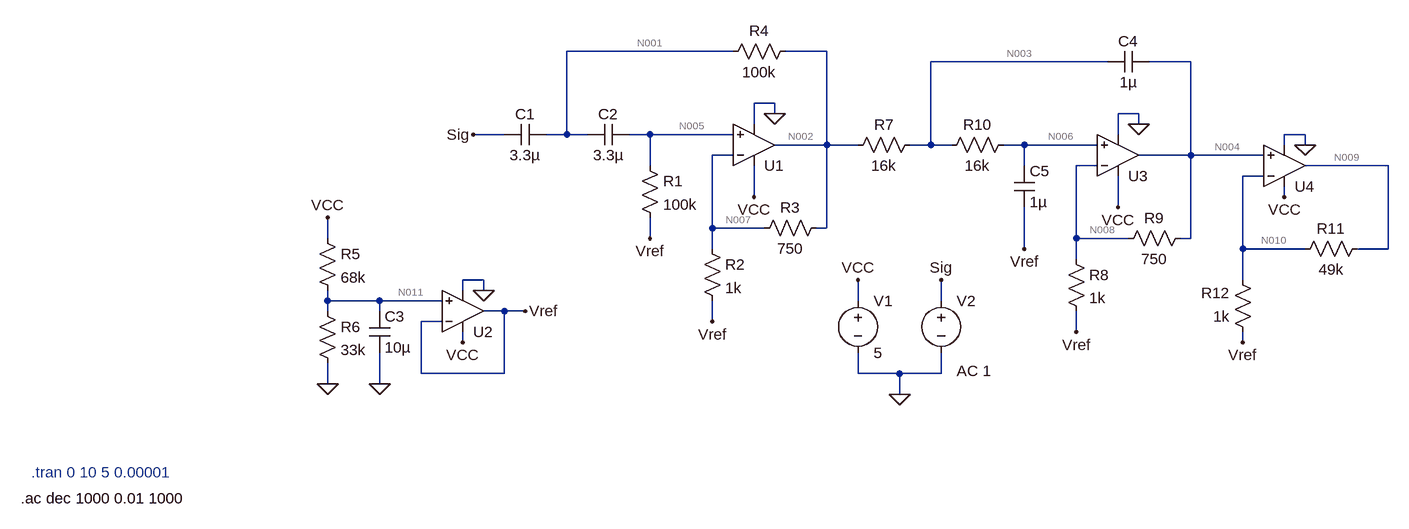
[diagram p0: schematic Draft3.asc]
Draft3.asc, the LTspice schematic file:
Version 4.1
SHEET 1 2260 680
WIRE 1120 -416 864 -416
WIRE 1264 -416 1200 -416
WIRE 1696 -400 1424 -400
WIRE 1824 -400 1760 -400
WIRE 1184 -336 1152 -336
WIRE 1184 -320 1184 -336
WIRE 1744 -320 1712 -320
WIRE 1152 -304 1152 -336
WIRE 1744 -304 1744 -320
WIRE 768 -288 720 -288
WIRE 864 -288 864 -416
WIRE 864 -288 832 -288
WIRE 896 -288 864 -288
WIRE 992 -288 960 -288
WIRE 1120 -288 992 -288
WIRE 1712 -288 1712 -320
WIRE 2000 -288 1968 -288
WIRE 1264 -272 1264 -416
WIRE 1264 -272 1184 -272
WIRE 1312 -272 1264 -272
WIRE 1424 -272 1424 -400
WIRE 1424 -272 1392 -272
WIRE 1456 -272 1424 -272
WIRE 1568 -272 1536 -272
WIRE 1680 -272 1568 -272
WIRE 1968 -272 1968 -288
WIRE 2000 -272 2000 -288
WIRE 1120 -256 1088 -256
WIRE 1824 -256 1824 -400
WIRE 1824 -256 1744 -256
WIRE 1936 -256 1824 -256
WIRE 992 -240 992 -288
WIRE 1568 -240 1568 -272
WIRE 1680 -240 1648 -240
WIRE 2128 -240 2000 -240
WIRE 1936 -224 1904 -224
WIRE 1152 -192 1152 -240
WIRE 1968 -192 1968 -208
WIRE 1712 -176 1712 -224
WIRE 1088 -144 1088 -256
WIRE 1168 -144 1088 -144
WIRE 1264 -144 1264 -272
WIRE 1264 -144 1248 -144
WIRE 496 -128 496 -160
WIRE 992 -128 992 -160
WIRE 1648 -128 1648 -240
WIRE 1728 -128 1648 -128
WIRE 1824 -128 1824 -256
WIRE 1824 -128 1808 -128
WIRE 1088 -112 1088 -144
WIRE 1568 -112 1568 -176
WIRE 1904 -112 1904 -224
WIRE 2000 -112 1904 -112
WIRE 2128 -112 2128 -240
WIRE 2128 -112 2080 -112
WIRE 1648 -96 1648 -128
WIRE 736 -64 704 -64
WIRE 1904 -64 1904 -112
WIRE 704 -48 704 -64
WIRE 736 -48 736 -64
WIRE 496 -32 496 -48
WIRE 576 -32 496 -32
WIRE 672 -32 576 -32
WIRE 1312 -32 1312 -64
WIRE 1440 -32 1440 -64
WIRE 496 -16 496 -32
WIRE 576 -16 576 -32
WIRE 768 -16 736 -16
WIRE 800 -16 768 -16
WIRE 672 0 640 0
WIRE 1088 0 1088 -32
WIRE 1648 16 1648 -16
WIRE 704 32 704 16
WIRE 1904 32 1904 16
WIRE 640 80 640 0
WIRE 768 80 768 -16
WIRE 768 80 640 80
WIRE 1312 80 1312 48
WIRE 1376 80 1312 80
WIRE 1440 80 1440 48
WIRE 1440 80 1376 80
WIRE 496 96 496 64
WIRE 576 96 576 48
WIRE 1376 112 1376 80
FLAG 1376 112 0
FLAG 1312 -64 VCC
FLAG 1440 -64 Sig
FLAG 720 -288 Sig
FLAG 1184 -320 0
FLAG 1152 -192 VCC
FLAG 736 -48 0
FLAG 704 32 VCC
FLAG 576 96 0
FLAG 496 96 0
FLAG 496 -160 VCC
FLAG 800 -16 Vref
FLAG 992 -128 Vref
FLAG 1088 0 Vref
FLAG 1744 -304 0
FLAG 1712 -176 VCC
FLAG 1568 -112 Vref
FLAG 1648 16 Vref
FLAG 2000 -272 0
FLAG 1968 -192 VCC
FLAG 1904 32 Vref
SYMBOL voltage 1312 -48 R0
WINDOW 123 0 0 Left 0
WINDOW 39 0 0 Left 0
SYMATTR InstName V1
SYMATTR Value 5
SYMBOL voltage 1440 -48 R0
WINDOW 123 24 124 Left 2
WINDOW 39 0 0 Left 0
SYMATTR InstName V2
SYMATTR Value ""
SYMATTR Value2 AC 1
SYMBOL cap 832 -304 R90
WINDOW 0 0 32 VBottom 2
WINDOW 3 32 32 VTop 2
SYMATTR InstName C1
SYMATTR Value 3.3µ
SYMBOL cap 960 -304 R90
WINDOW 0 0 32 VBottom 2
WINDOW 3 32 32 VTop 2
SYMATTR InstName C2
SYMATTR Value 3.3µ
SYMBOL res 976 -256 R0
SYMATTR InstName R1
SYMATTR Value 100k
SYMBOL OpAmps\\UniversalOpAmp2 1152 -272 M180
SYMATTR InstName U1
SYMBOL res 1072 -128 R0
SYMATTR InstName R2
SYMATTR Value 1k
SYMBOL res 1264 -160 R90
WINDOW 0 0 56 VBottom 2
WINDOW 3 32 56 VTop 2
SYMATTR InstName R3
SYMATTR Value 750
SYMBOL res 1216 -432 R90
WINDOW 0 0 56 VBottom 2
WINDOW 3 32 56 VTop 2
SYMATTR InstName R4
SYMATTR Value 100k
SYMBOL res 480 -144 R0
SYMATTR InstName R5
SYMATTR Value 68k
SYMBOL res 480 -32 R0
SYMATTR InstName R6
SYMATTR Value 33k
SYMBOL cap 560 -16 R0
SYMATTR InstName C3
SYMATTR Value 10µ
SYMBOL OpAmps\\UniversalOpAmp2 704 -16 M180
SYMATTR InstName U2
SYMBOL OpAmps\\UniversalOpAmp2 1712 -256 M180
SYMATTR InstName U3
SYMBOL res 1632 -112 R0
SYMATTR InstName R8
SYMATTR Value 1k
SYMBOL res 1824 -144 R90
WINDOW 0 0 56 VBottom 2
WINDOW 3 32 56 VTop 2
SYMATTR InstName R9
SYMATTR Value 750
SYMBOL res 1408 -288 R90
WINDOW 0 0 56 VBottom 2
WINDOW 3 32 56 VTop 2
SYMATTR InstName R7
SYMATTR Value 16k
SYMBOL res 1552 -288 R90
WINDOW 0 0 56 VBottom 2
WINDOW 3 32 56 VTop 2
SYMATTR InstName R10
SYMATTR Value 16k
SYMBOL cap 1760 -416 R90
WINDOW 0 0 32 VBottom 2
WINDOW 3 32 32 VTop 2
SYMATTR InstName C4
SYMATTR Value 1µ
SYMBOL cap 1552 -240 R0
SYMATTR InstName C5
SYMATTR Value 1µ
SYMBOL OpAmps\\UniversalOpAmp2 1968 -240 M180
SYMATTR InstName U4
SYMBOL res 2096 -128 R90
WINDOW 0 0 56 VBottom 2
WINDOW 3 32 56 VTop 2
SYMATTR InstName R11
SYMATTR Value 49k
SYMBOL res 1920 32 R180
WINDOW 0 36 76 Left 2
WINDOW 3 36 40 Left 2
SYMATTR InstName R12
SYMATTR Value 1k
TEXT 40 232 Left 2 ;.tran 0 10 5 0.00001
TEXT 24 272 Left 2 !.ac dec 1000 0.01 1000

The netlist it stands for:
* Draft3.asc
V1 VCC 0 5
V2 Sig 0 AC 1
C1 N001 Sig 3.3µ
C2 N005 N001 3.3µ
R1 N005 Vref 100k
X§U1 N005 N007 VCC 0 N002 level2 Avol=1Meg GBW=10Meg Slew=10Meg Ilimit=25m Rail=0 Vos=0 En=0 Enk=0 In=0 Ink=0 Rin=500Meg  ; pins In+ In- V+ V- OUT
R2 N007 Vref 1k
R3 N002 N007 750
R4 N002 N001 100k
R5 VCC N011 68k
R6 N011 0 33k
C3 N011 0 10µ
X§U2 N011 Vref VCC 0 Vref level2 Avol=1Meg GBW=10Meg Slew=10Meg Ilimit=25m Rail=0 Vos=0 En=0 Enk=0 In=0 Ink=0 Rin=500Meg  ; pins In+ In- V+ V- OUT
X§U3 N006 N008 VCC 0 N004 level2 Avol=1Meg GBW=10Meg Slew=10Meg Ilimit=25m Rail=0 Vos=0 En=0 Enk=0 In=0 Ink=0 Rin=500Meg  ; pins In+ In- V+ V- OUT
R8 N008 Vref 1k
R9 N004 N008 750
R7 N003 N002 16k
R10 N006 N003 16k
C4 N004 N003 1µ
C5 N006 Vref 1µ
X§U4 N004 N010 VCC 0 N009 level2 Avol=1Meg GBW=10Meg Slew=10Meg Ilimit=25m Rail=0 Vos=0 En=0 Enk=0 In=0 Ink=0 Rin=500Meg  ; pins In+ In- V+ V- OUT
R11 N009 N010 49k
R12 Vref N010 1k
* .tran 0 10 5 0.00001
.ac dec 1000 0.01 1000
.lib UniversalOpAmp2.lib
.backanno
.end

* Results of the author's LTspice run, read from the files saved beside the schematic
* Operating Point, zero values left out:
*   V(n001) = 1.634 V
*   V(n002) = 1.634 V
*   V(n003) = 1.634 V
*   V(n004) = 1.634 V
*   V(n005) = 1.634 V
*   V(n006) = 1.634 V
*   V(n007) = 1.634 V
*   V(n008) = 1.634 V
*   V(n009) = 1.665 V
*   V(n010) = 1.634 V
*   V(n011) = 1.634 V
*   V(vcc) = 5 V
*   V(vref) = 1.634 V
*   I(R1) = 1.732 nA
*   I(R10) = 1.732 nA
*   I(R11) = 627.2 nA
*   I(R12) = -629 nA
*   I(R2) = 174.1 nA
*   I(R3) = 172.4 nA
*   I(R5) = 49.5 µA
*   I(R6) = 49.51 µA
*   I(R7) = 1.732 nA
*   I(R8) = 359.7 nA
*   I(R9) = 357.9 nA
*   I(V1) = -988.8 µA
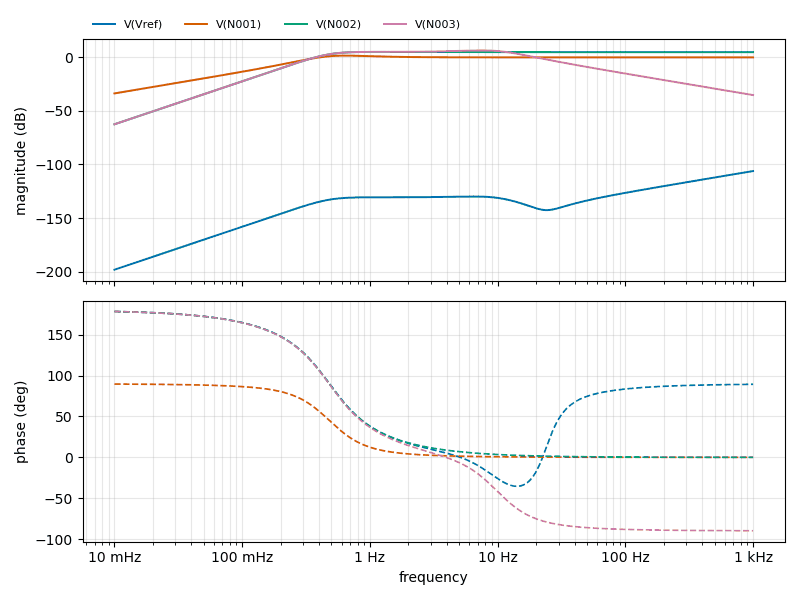
[diagram p1: AC Analysis of Draft3.asc, plotted from the saved traces]
* AC Analysis, 1 run:
*   V(Vref): -198.26 dB at 10 mHz, -106.15 dB at 1 kHz, peak -106.15 dB at 1 kHz, 3 dB below the peak at 707.4 Hz
*   V(N001): -33.66 dB at 10 mHz, 0.00 dB at 1 kHz, peak 1.64 dB at 644.2 mHz, 3 dB below the peak at 341.6 mHz
*   V(N002): -62.47 dB at 10 mHz, 4.86 dB at 1 kHz, peak 5.07 dB at 1.033 Hz, 3 dB below the peak at 441.4 mHz
*   V(N003): -62.47 dB at 10 mHz, -35.19 dB at 1 kHz, peak 6.51 dB at 7.447 Hz, 3 dB below the peak at 518 mHz and 14.04 Hz